# Altium schematic sheet Ethernet PHY.SchDoc
size A4; SheetNumber: 3; SheetTotal: 10
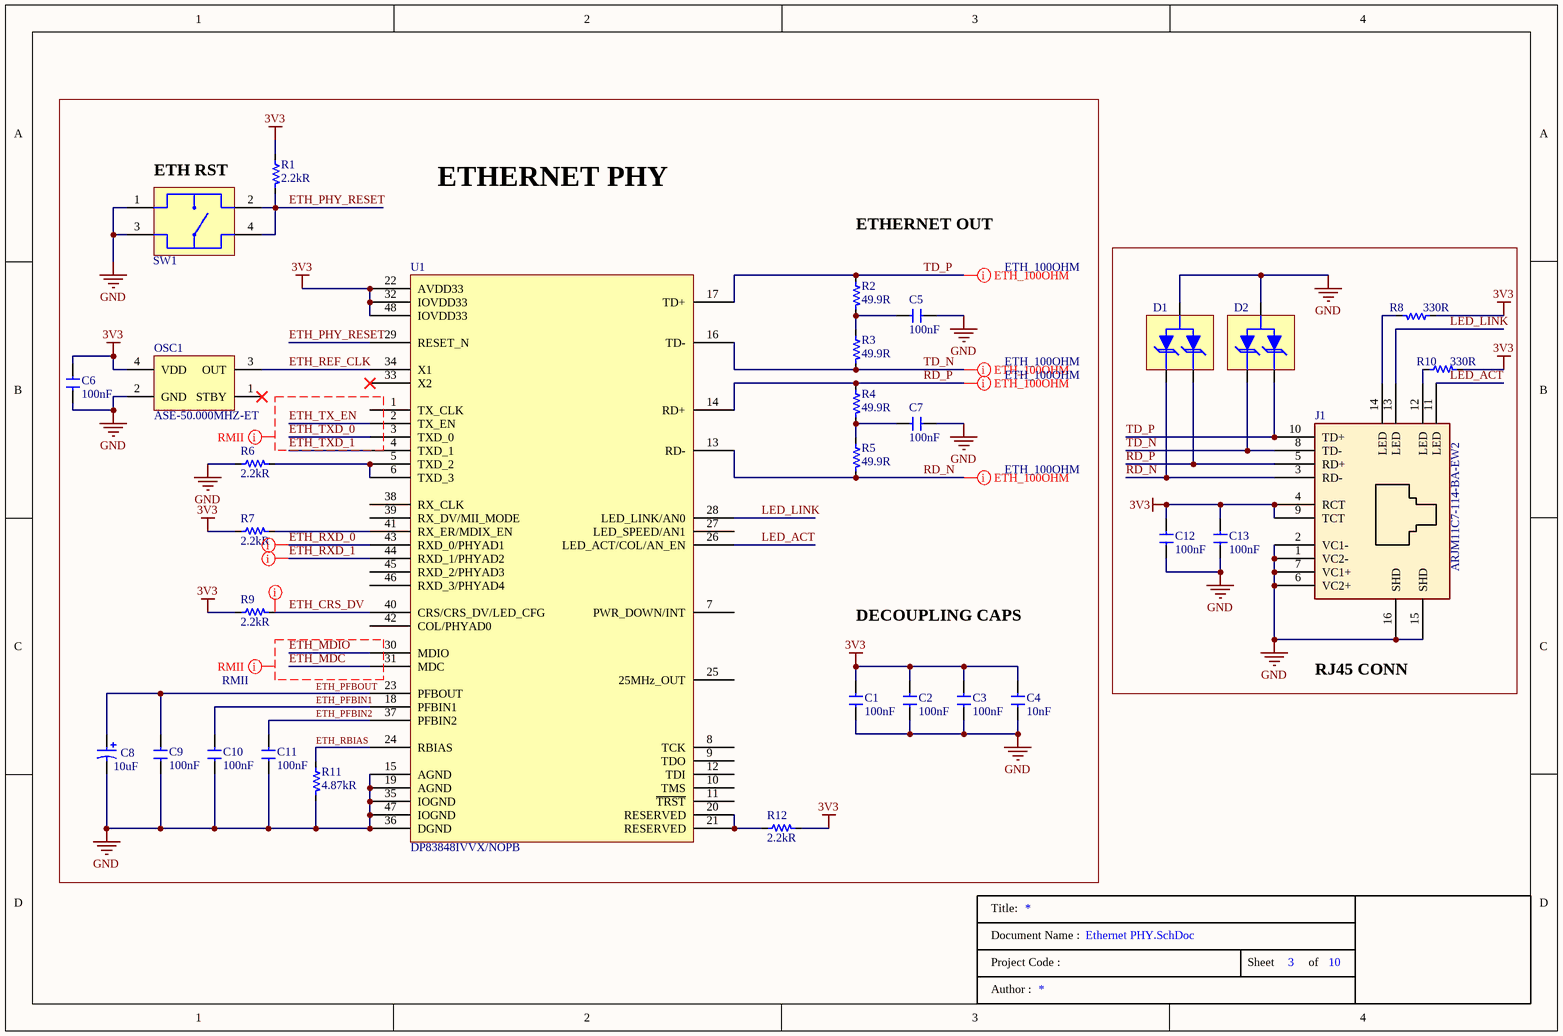
[diagram p0: Ethernet PHY.SchDoc]

## Parts
C1  Capacitance: 100nF  [0805_CAP]  (hidden comment: CAP_0.1uF_%20_50V_0805_X7R_CER)
C2  Capacitance: 100nF  [0805_CAP]  (hidden comment: CAP_0.1uF_%20_50V_0805_X7R_CER)
C3  Capacitance: 100nF  [0805_CAP]  (hidden comment: CAP_0.1uF_%20_50V_0805_X7R_CER)
C4  Capacitance: 10nF  [0805_CAP]  (hidden comment: CAP_10nF_%10_50V_0805_X7R_CER)
C5  Capacitance: 100nF  [0805_CAP]  (hidden comment: CAP_0.1uF_50V_0805_X7R_CER)
C6  Capacitance: 100nF  [0805_CAP]  (hidden comment: CAP_0.1uF_50V_0805_X7R_CER)
C7  Capacitance: 100nF  [0805_CAP]  (hidden comment: CAP_0.1uF_50V_0805_X7R_CER)
C8  Capacitance: 10uF  [1206_TANT_CAP]  (hidden comment: CAP_10uF_10V_10%_1206_TANT)
C9  Capacitance: 100nF  [0805_CAP]  (hidden comment: CAP_0.1uF_%20_50V_0805_X7R_CER)
C10  Capacitance: 100nF  [0805_CAP]  (hidden comment: CAP_0.1uF_%20_50V_0805_X7R_CER)
C11  Capacitance: 100nF  [0805_CAP]  (hidden comment: CAP_0.1uF_%20_50V_0805_X7R_CER)
C12  Capacitance: 100nF  [0805_CAP]  (hidden comment: CAP_0.1uF_50V_0805_X7R_CER)
C13  Capacitance: 100nF  [0805_CAP]  (hidden comment: CAP_0.1uF_50V_0805_X7R_CER)
D1  DIODE_TVS_3.3VWM_8VC_SOT23  [SOT170P237X110-3N]  (value not drawn)
D2  DIODE_TVS_3.3VWM_8VC_SOT23  [SOT170P237X110-3N]  (value not drawn)
J1  ARJM11C7-114-BA-EW2  [ARJM11C7-114-BA-EW2_ABR]
OSC1  ASE-50.000MHZ-ET  [4-SMD_CMOS_OSC_3.20MMX2.50]
R1  Resistance: 2.2kR  [0805_RES]  (hidden comment: RES_2.2K OHM_1%_0805_1/8W)
R2  Resistance: 49.9R  [0603_RES]  (hidden comment: RES_49.9 OHM_1%_0603_1/10W)
R3  Resistance: 49.9R  [0603_RES]  (hidden comment: RES_49.9 OHM_1%_0603_1/10W)
R4  Resistance: 49.9R  [0603_RES]  (hidden comment: RES_49.9 OHM_1%_0603_1/10W)
R5  Resistance: 49.9R  [0603_RES]  (hidden comment: RES_49.9 OHM_1%_0603_1/10W)
R6  Resistance: 2.2kR  [0805_RES]  (hidden comment: RES_2.2K OHM_1%_0805_1/8W)
R7  Resistance: 2.2kR  [0805_RES]  (hidden comment: RES_2.2K OHM_1%_0805_1/8W)
R8  Resistance: 330R  [0805_RES]  (hidden comment: RES_330 OHM_5%_0805_1/8W)
R9  Resistance: 2.2kR  [0805_RES]  (hidden comment: RES_2.2K OHM_1%_0805_1/8W)
R10  Resistance: 330R  [0805_RES]  (hidden comment: RES_330 OHM_5%_0805_1/8W)
R11  Resistance: 4.87kR  [0805_RES]  (hidden comment: RES_4.87K_OHM_1%_1/8W 0805)
R12  Resistance: 2.2kR  [0805_RES]  (hidden comment: RES_2.2K OHM_1%_0805_1/8W)
SW1  SWITCH_TACTILE_SPST-NO_0.05A_12V  [TACT_SWITCH_6MMX6MM]  (value not drawn)
U1  DP83848IVVX/NOPB  [TSQFP50P900X900X160-48N]

## Blocks framed on the sheet
ETHERNET PHY: C1-C11 OSC1 R1-R7 R9 R11 R12 SW1 U1
RJ45 CONN: C12 C13 D1 D2 J1 R8 R10

## Nets
3V3: C1.2 C2.2 C3.2 C4.2 C6.2 C12.1 C13.1 J1.4(RCT) J1.9(TCT) OSC1.4(VDD) R1.2 R7.2 R8.2 R9.2 R10.1 R12.1 U1.22(AVDD33) U1.32(IOVDD33) U1.48(IOVDD33)
GND: C1.1 C2.1 C3.1 C4.1 C5.1 C6.1 C7.1 C8.2 C9.1 C10.1 C11.1 C12.2 C13.2 D1.3(ANODE) D2.3(ANODE) J1.1(VC2-) J1.2(VC1-) J1.6(VC2+) J1.7(VC1+) J1.15(SHD) J1.16(SHD) OSC1.2(GND) R6.2 R11.1 SW1.1 SW1.3 U1.15(AGND) U1.19(AGND) U1.35(IOGND) U1.36(DGND) U1.47(IOGND)
ETH_CRS_DV: R9.1 U1.40(CRS/CRS_DV/LED_CFG)
ETH_MDC: U1.31(MDC)
ETH_MDIO: U1.30(MDIO)
ETH_PFBIN1: C10.2 U1.18(PFBIN1)
ETH_PFBIN2: C11.2 U1.37(PFBIN2)
ETH_PFBOUT: C8.1 C9.2 U1.23(PFBOUT)
ETH_PHY_RESET: R1.1 SW1.2 SW1.4 U1.29(RESET_N)
ETH_RBIAS: R11.2 U1.24(RBIAS)
ETH_REF_CLK: OSC1.3(OUT) U1.34(X1)
ETH_RXD_0: U1.43(RXD_0/PHYAD1)
ETH_RXD_1: U1.44(RXD_1/PHYAD2)
ETH_TX_EN: U1.2(TX_EN)
ETH_TXD_0: U1.3(TXD_0)
ETH_TXD_1: U1.4(TXD_1)
LED_ACT: J1.11(LED) U1.26(LED_ACT/COL/AN_EN)
LED_LINK: J1.13(LED) U1.28(LED_LINK/AN0)
RD_N: D1.1(CATHODE_1) J1.3(RD-) R5.1 U1.13(RD-)
RD_P: D1.2(CATHODE_2) J1.5(RD+) R4.2 U1.14(RD+)
TD_N: D2.1(CATHODE_1) J1.8(TD-) R3.1 U1.16(TD-)
TD_P: D2.2(CATHODE_2) J1.10(TD+) R2.2 U1.17(TD+)
NetC5_2: C5.2 R2.1 R3.2
NetC7_2: C7.2 R4.1 R5.2
NetJ1_12: J1.12(LED) R10.2
NetJ1_14: J1.14(LED) R8.1
NetR6_1: R6.1 U1.5(TXD_2) U1.6(TXD_3)
NetR7_1: R7.1 U1.41(RX_ER/MDIX_EN)
NetR12_2: R12.2 U1.20(RESERVED) U1.21(RESERVED)

Not connected (* = marked no-connect by the designer): OSC1 1(STBY)*; U1 1(TX_CLK) 7(PWR_DOWN/INT) 8(TCK) 9(TDO) 10(TMS) 11(~{TRST}) 12(TDI) 25(25MHz_OUT) 27(LED_SPEED/AN1) 33(X2)* 38(RX_CLK) 39(RX_DV/MII_MODE) 42(COL/PHYAD0) 45(RXD_2/PHYAD3) 46(RXD_3/PHYAD4)

## Layout directives
differential pair; differential pair class ETH_100OHM: RD_N, RD_P, TD_N, TD_P
net class RMII: ETH_CRS_DV, ETH_MDC, ETH_MDIO, ETH_RXD_0, ETH_RXD_1, ETH_TX_EN, ETH_TXD_0, ETH_TXD_1

## Notes on the sheet
- (near SW1) ETH RST
- (near R2) ETHERNET OUT
- DECOUPLING CAPS
- Title:
- Document Name :
- Project Code :
- Sheet
- of
- Author :

## Library data of the parts
C1-C3 C9-C11 = CAP_0.1uF_%20_50V_0805_X7R_CER: Cap Ceramic 0.1uF 50V X7R 20% SMD 0805 125C Paper T/R; Manufacturer: KEMET; Manufacturer Part Number: C0805C104M5RACTU; Supplier 1: Digi-Key; RoHS: Yes; Category: Ceramic Capacitors; Stock 1: 4863; Pricing 1: 1=0,10000, 10=0,06400, 50=0,03500, 100=0,02860, 500=0,02040, 1000=0,01603 (USD); Mount: Surface Mount; Case/Package: 0805; Dielectric Material: Ceramic; Min Operating Temperature: -55°C; Max Operating Temperature: 125°C; Tolerance: 20%; Dielectric: X7R; Packaging: Tape and Reel; Voltage Rating (DC): 50V; Length: 2mm; Height: 0.9mm; Depth: 1.25mm; Radiation Hardening: No; ComponentLink1URL: http://uk.rs-online.com/webdocs/13da/0900766b813daa06.pdf?src-supplier=RSComponents; ComponentLink1Description: http://uk.rs-online.com/webdocs/13da/0900766b813daa06.pdf?src-supplier=RSComponents; ComponentLink2URL: https://www.verical.com/server-webapp/html/getDatasheet?partID=774625&src-supplier=Verical; ComponentLink2Description: https://www.verical.com/server-webapp/html/getDatasheet?partID=774625&src-supplier=Verical; ComponentLink3URL: http://www.farnell.com/datasheets/2739857.pdf?src-supplier=Farnell; ComponentLink3Description: http://www.farnell.com/datasheets/2739857.pdf?src-supplier=Farnell; ComponentLink4URL: http://uk.rs-online.com/webdocs/1515/0900766b81515223.pdf?src-supplier=RSComponents; ComponentLink4Description: http://uk.rs-online.com/webdocs/1515/0900766b81515223.pdf?src-supplier=RSComponents; ComponentLink5URL: http://components.arrow.com/part/dataview/0323_00324812?src-supplier=Arrow+Europe; ComponentLink5Description: http://components.arrow.com/part/dataview/0323_00324812?src-supplier=Arrow+Europe; ComponentLink6URL: http://uk.rs-online.com/webdocs/1528/0900766b81528e2f.pdf?src-supplier=RSComponents; ComponentLink6Description: http://uk.rs-online.com/webdocs/1528/0900766b81528e2f.pdf?src-supplier=RSComponents; ComponentLink7URL: http://www.farnell.com/datasheets/2739857.pdf?src-supplier=Newark; ComponentLink7Description: http://www.farnell.com/datasheets/2739857.pdf?src-supplier=Newark; ComponentLink8URL: http://www.alliedelec.com/m/d/9bfe7773041ffe9d406e68bc7b377fdd.pdf?src-supplier=Allied+Electronics; ComponentLink8Description: http://www.alliedelec.com/m/d/9bfe7773041ffe9d406e68bc7b377fdd.pdf?src-supplier=Allied+Electronics; ComponentLink9URL: https://api.kemet.com/component-edge/download/datasheet/C0805C104M5RACTU.pdf?src-supplier=Digi-Key; ComponentLink9Description: https://api.kemet.com/component-edge/download/datasheet/C0805C104M5RACTU.pdf?src-supplier=Digi-Key; ComponentLink10URL: http://capacitoredge.kemet.com/capedge2/DataSheet?pn=C0805C104M5RACTU&src-supplier=Avnet+Europe; ComponentLink10Description: http://capacitoredge.kemet.com/capedge2/DataSheet?pn=C0805C104M5RACTU&src-supplier=Avnet+Europe; ComponentLink11URL: http://www.farnell.com/datasheets/2739857.pdf?src-supplier=Element14; ComponentLink11Description: http://www.farnell.com/datasheets/2739857.pdf?src-supplier=Element14; ComponentLink12URL: http://www.mouser.com/ds/2/212/KEM_C1002_X7R_SMD-1102033.pdf?src-supplier=Mouser; ComponentLink12Description: http://www.mouser.com/ds/2/212/KEM_C1002_X7R_SMD-1102033.pdf?src-supplier=Mouser; ComponentLink13URL: https://www.verical.com/server-webapp/html/getDatasheet?partID=91523&src-supplier=Verical; ComponentLink13Description: https://www.verical.com/server-webapp/html/getDatasheet?partID=91523&src-supplier=Verical; ComponentLink14URL: http://components.arrow.com/part/dataview/2091108S8109171N7429?src-supplier=Arrow+Electronics; ComponentLink14Description: http://components.arrow.com/part/dataview/2091108S8109171N7429?src-supplier=Arrow+Electronics; Supplier Part Number 1: 399-C0805C104M5RAC7800CT-ND
C4 = CAP_10nF_%10_50V_0805_X7R_CER: CAP CER 10000PF 50V X7R 0805; Manufacturer: Samsung; Manufacturer Part Number: CL21B103KBANNNC; Material: Ceramic; Tolerance: 10%; Supplier 1: Digi-Key; RoHS: Yes; Category: Ceramic Capacitors; Stock 1: 1431273; Pricing 1: 1=0,10000, 10=0,04600, 50=0,02500, 100=0,02050, 500=0,01464, 1000=0,01150 (USD); Mount: Surface Mount; Case/Package: 0805; Case Code (Metric): 2012; Case Code (Imperial): 0805; Contact Plating: Tin; Min Operating Temperature: -55°C; Max Operating Temperature: 125°C; Dielectric: X7R; Voltage: 50V; Voltage Rating (DC): 50V; Packaging: Tape and Reel; Voltage Rating: 50V; Series: CL; Construction: Flat; Length: 2mm; Width: 0.049inch; Height: 0.65mm; Depth: 1.25mm; Thickness: 0.03inch; Radiation Hardening: No; Lead Free: Lead Free; RoHS Compliant: Yes; ComponentLink1URL: https://datasheet.ciiva.com/25709/cl21b103kbannnc-25709781.pdf?src-supplier=Digi-Key; ComponentLink1Description: https://datasheet.ciiva.com/25709/cl21b103kbannnc-25709781.pdf?src-supplier=Digi-Key; ComponentLink2URL: https://datasheet.ciiva.com/29199/455082-da-01-en-vs-kondensator-0805-29199459.pdf?src-supplier=Conrad; ComponentLink2Description: https://datasheet.ciiva.com/29199/455082-da-01-en-vs-kondensator-0805-29199459.pdf?src-supplier=Conrad; Supplier Part Number 1: 1276-1015-1-ND
C5-C7 C12 C13 = CAP_0.1uF_50V_0805_X7R_CER: Cap Ceramic 0.1uF 50V X7R 20% SMD 0805 125C Paper T/R; Manufacturer: KEMET; Manufacturer Part Number: C0805C104M5RACTU; Supplier 1: Digi-Key; RoHS: Yes; Category: Ceramic Capacitors; Stock 1: 4863; Pricing 1: 1=0,10000, 10=0,06400, 50=0,03500, 100=0,02860, 500=0,02040, 1000=0,01603 (USD); Mount: Surface Mount; Case/Package: 0805; Dielectric Material: Ceramic; Min Operating Temperature: -55°C; Max Operating Temperature: 125°C; Tolerance: 20%; Dielectric: X7R; Packaging: Tape and Reel; Voltage Rating (DC): 50V; Length: 2mm; Height: 0.9mm; Depth: 1.25mm; Radiation Hardening: No; ComponentLink1URL: http://uk.rs-online.com/webdocs/13da/0900766b813daa06.pdf?src-supplier=RSComponents; ComponentLink1Description: http://uk.rs-online.com/webdocs/13da/0900766b813daa06.pdf?src-supplier=RSComponents; ComponentLink2URL: https://www.verical.com/server-webapp/html/getDatasheet?partID=774625&src-supplier=Verical; ComponentLink2Description: https://www.verical.com/server-webapp/html/getDatasheet?partID=774625&src-supplier=Verical; ComponentLink3URL: http://www.farnell.com/datasheets/2739857.pdf?src-supplier=Farnell; ComponentLink3Description: http://www.farnell.com/datasheets/2739857.pdf?src-supplier=Farnell; ComponentLink4URL: http://uk.rs-online.com/webdocs/1515/0900766b81515223.pdf?src-supplier=RSComponents; ComponentLink4Description: http://uk.rs-online.com/webdocs/1515/0900766b81515223.pdf?src-supplier=RSComponents; ComponentLink5URL: http://components.arrow.com/part/dataview/0323_00324812?src-supplier=Arrow+Europe; ComponentLink5Description: http://components.arrow.com/part/dataview/0323_00324812?src-supplier=Arrow+Europe; ComponentLink6URL: http://uk.rs-online.com/webdocs/1528/0900766b81528e2f.pdf?src-supplier=RSComponents; ComponentLink6Description: http://uk.rs-online.com/webdocs/1528/0900766b81528e2f.pdf?src-supplier=RSComponents; ComponentLink7URL: http://www.farnell.com/datasheets/2739857.pdf?src-supplier=Newark; ComponentLink7Description: http://www.farnell.com/datasheets/2739857.pdf?src-supplier=Newark; ComponentLink8URL: http://www.alliedelec.com/m/d/9bfe7773041ffe9d406e68bc7b377fdd.pdf?src-supplier=Allied+Electronics; ComponentLink8Description: http://www.alliedelec.com/m/d/9bfe7773041ffe9d406e68bc7b377fdd.pdf?src-supplier=Allied+Electronics; ComponentLink9URL: https://api.kemet.com/component-edge/download/datasheet/C0805C104M5RACTU.pdf?src-supplier=Digi-Key; ComponentLink9Description: https://api.kemet.com/component-edge/download/datasheet/C0805C104M5RACTU.pdf?src-supplier=Digi-Key; ComponentLink10URL: http://capacitoredge.kemet.com/capedge2/DataSheet?pn=C0805C104M5RACTU&src-supplier=Avnet+Europe; ComponentLink10Description: http://capacitoredge.kemet.com/capedge2/DataSheet?pn=C0805C104M5RACTU&src-supplier=Avnet+Europe; ComponentLink11URL: http://www.farnell.com/datasheets/2739857.pdf?src-supplier=Element14; ComponentLink11Description: http://www.farnell.com/datasheets/2739857.pdf?src-supplier=Element14; ComponentLink12URL: http://www.mouser.com/ds/2/212/KEM_C1002_X7R_SMD-1102033.pdf?src-supplier=Mouser; ComponentLink12Description: http://www.mouser.com/ds/2/212/KEM_C1002_X7R_SMD-1102033.pdf?src-supplier=Mouser; ComponentLink13URL: https://www.verical.com/server-webapp/html/getDatasheet?partID=91523&src-supplier=Verical; ComponentLink13Description: https://www.verical.com/server-webapp/html/getDatasheet?partID=91523&src-supplier=Verical; ComponentLink14URL: http://components.arrow.com/part/dataview/2091108S8109171N7429?src-supplier=Arrow+Electronics; ComponentLink14Description: http://components.arrow.com/part/dataview/2091108S8109171N7429?src-supplier=Arrow+Electronics; Supplier Part Number 1: 399-C0805C104M5RAC7800CT-ND
C8 = CAP_10uF_10V_10%_1206_TANT: Cap Tant Solid 10uF 10V A CASE 10% (3.2 X 1.6 X 1.6mm) Inward L SMD 3216-18 3 Ohm 125C T/R; Manufacturer: Kyocera AVX; Manufacturer Part Number: TAJA106K010SNJ; ESR (Equivalent Series Resistance): 3R; Leakage Current: 1uA; Polarity: Polar; Dissipation Factor: 6%; Supplier 1: Digi-Key; RoHS: Yes; Category: Tantalum Capacitors; Stock 1: 14579; Pricing 1: 1=0,31000, 10=0,21300, 50=0,14920, 100=0,12780, 500=0,09584, 1000=0,08094, 2500=0,07668 (USD); Case/Package: Molded; Number of Pins: 2; Case Code (Imperial): 1206; Case Code (Metric): 3216; Min Operating Temperature: -55°C; Max Operating Temperature: 125°C; Tolerance: 10%; Packaging: Tape and Reel; Voltage Rating: 10V; Package Quantity: 8000; Termination: SMD/SMT; Voltage Rating (DC): 10V; Series: TAJ; Construction: Flat; Length: 3.2mm; Width: 1.6mm; Height: 1.8mm; Depth: 1.6mm; Radiation Hardening: No; Lead Free: Lead Free; RoHS Compliant: Yes; ComponentLink1URL: https://datasheet.ciiva.com/12909/taj-27497-12909898.pdf?src-supplier=Mouser; ComponentLink1Description: https://datasheet.ciiva.com/12909/taj-27497-12909898.pdf?src-supplier=Mouser; Supplier Part Number 1: 478-13122-1-ND
D1 D2 = DIODE_TVS_3.3VWM_8VC_SOT23: ESD Suppressor TVS Uni-Dir 3.3V 3-Pin SOT-23 T/R; Manufacturer: MCC; Manufacturer Part Number: ESD3V3AP-TP; Number of Unidirectional Channels: 2; Min Breakdown Voltage: 5V; Clamping Voltage: 7.5V; Peak Pulse Current: 13.3A; Peak Pulse Power: 300W; Power Line Protection: No; Supplier 1: Digi-Key; RoHS: Yes; Category: TVS Diodes; Stock 1: 509; Pricing 1: 1=0,35000, 10=0,26400, 100=0,14950, 500=0,09900, 1000=0,07590 (USD); Mount: Surface Mount; Case/Package: TO-236-3; Min Operating Temperature: -55°C; Max Operating Temperature: 150°C; Resistor Type: Zener; Packaging: Tape and Reel; Reverse Standoff Voltage: 3.3V; RoHS Compliant: Yes; ComponentLink1URL: http://www.mccsemi.com/up_pdf/ESD3V3AP(SOT-23).pdf?src-supplier=Digi-Key; ComponentLink1Description: http://www.mccsemi.com/up_pdf/ESD3V3AP(SOT-23).pdf?src-supplier=Digi-Key; ComponentLink2URL: https://www.mccsemi.com/pdf/Products/ESD3V3AP(SOT-23).pdf?src-supplier=Digi-Key; ComponentLink2Description: https://www.mccsemi.com/pdf/Products/ESD3V3AP(SOT-23).pdf?src-supplier=Digi-Key; Supplier Part Number 1: ESD3V3AP-TPMSCT-ND
J1 = CONN_RJ-45_JACK_1PORT 100 BASE-T PoE_w/LED: Conn RJ-45 F 8 POS 1.27mm Solder RA Thru-Hole 14 Terminal 1 Port Tray; Manufacturer: Abracon; Connector Type: RJ45; Direction: Up; Number of Ports: 1; Number of Cores per Jack: 4; Shielding: Shielded; Supplier 1: Digi-Key; Manufacturer Part Number: ARJM11C7-114-BA-EW2; RoHS: Yes; Category: Modular / Ethernet Connectors; Stock 1: 66; Pricing 1: 1=3,29000, 10=2,98300, 25=2,82560, 40=2,76000, 100=2,62850, 300=2,29993, 500=2,23420, 1000=1,90565, 2400=1,77423 (USD); Mount: Through Hole; Color: Green,Yellow; Contact Plating: Gold; Min Operating Temperature: -40°C; Max Operating Temperature: 85°C; Packaging: Tray; Number of Rows: 1; Termination: Solder; RoHS Compliant: Yes; Supplier Part Number 1: 535-14168-ND
OSC1 = XTAL_OSC_XO_50.0000MHZ_CMOS_SMD: 3.2 X 2.5 X 1.1Mm, 3.3V , 100Ppm -20+70C, Smd Ceramic Oscillator Rohs Compliant: Yes; Manufacturer: Abracon; Frequency: 50MHz; Load Capacitance: 15pF; Max Supply Current: 19mA; Supplier 1: Digi-Key; RoHS: Yes; Category: Oscillators; Stock 1: 12937; Pricing 1: 1=1,38000, 10=1,32100, 50=1,29020, 100=1,10590, 500=1,07520 (USD); Mount: Surface Mount; Case/Package: SMD/SMT; Number of Pins: 4; Min Operating Temperature: -20°C; Max Operating Temperature: 70°C; Packaging: Tape and Reel; Operating Supply Voltage: 3.3V; Frequency Stability: 100ppm; Termination: SMD/SMT; Series: ASE; Length: 3.2mm; Width: 2.5mm; Height: 0.047inch; Depth: 2.5mm; Radiation Hardening: No; REACH SVHC: No SVHC; Lead Free: Lead Free; ComponentLink1URL: https://datasheet.ciiva.com/865/aseseries-865948.pdf?src-supplier=Digi-Key; ComponentLink1Description: https://datasheet.ciiva.com/865/aseseries-865948.pdf?src-supplier=Digi-Key; ComponentLink2URL: https://datasheet.ciiva.com/865/aseseries-865947.pdf?src-supplier=Digi-Key; ComponentLink2Description: https://datasheet.ciiva.com/865/aseseries-865947.pdf?src-supplier=Digi-Key; ComponentLink3URL: https://datasheet.ciiva.com/865/aseseries-865949.pdf?src-supplier=Digi-Key; ComponentLink3Description: https://datasheet.ciiva.com/865/aseseries-865949.pdf?src-supplier=Digi-Key; ComponentLink4URL: https://datasheet.ciiva.com/3177/aseseries-3177741.pdf?src-supplier=Avnet; ComponentLink4Description: https://datasheet.ciiva.com/3177/aseseries-3177741.pdf?src-supplier=Avnet; ComponentLink5URL: https://datasheet.ciiva.com/16413/aseseries-16413061.pdf?src-supplier=Future+Electronics; ComponentLink5Description: https://datasheet.ciiva.com/16413/aseseries-16413061.pdf?src-supplier=Future+Electronics; Manufacturer Part Number: ASE-50.000MHZ-ET; Supplier Part Number 1: 535-9996-1-ND
R1 R6 R7 R9 R12 = RES_2.2K OHM_1%_0805_1/8W: Res Thick Film 0805 2.2K Ohm 1% 1/8W ±100ppm/°C SMD Paper T/R; Manufacturer: Yageo; Manufacturer Part Number: RC0805FR-132K2L; Power Rating: 125mW; Voltage Rating: 150V; Supplier 1: Digi-Key; RoHS: Yes; Category: Chip SMD Resistors; Stock 1: 72435; Pricing 1: 1=0,10000, 10=0,04200, 100=0,01690, 1000=0,00759, 2500=0,00659, 5000=0,00544 (USD); Case/Package: 0805; Contact Plating: Tin,Matte,Lead; Case Code (Imperial): 0805; Case Code (Metric): 2012; Min Operating Temperature: -55°C; Max Operating Temperature: 155°C; Tolerance: 1%; Resistor Type: Thick Film; Temperature Coefficient: 100ppm/°C; Packaging: Tape and Reel; Termination: SMD/SMT; Series: RC; Length: 2mm; Width: 1.25mm; Height: 0.5mm; Radiation Hardening: No; RoHS Compliant: Yes; ComponentLink1URL: https://datasheet.ciiva.com/12575/rc0805-257173-12575737.pdf?src-supplier=Mouser; ComponentLink1Description: https://datasheet.ciiva.com/12575/rc0805-257173-12575737.pdf?src-supplier=Mouser; Supplier Part Number 1: 13-RC0805FR-132K2LCT-ND
R2-R5 = RES_49.9 OHM_1%_0603_1/10W: Res Thick Film 0603 49.9 Ohm 1% 1/10W ±100ppm/°C Molded SMD Paper T/R; Manufacturer: Vishay; Manufacturer Part Number: CRCW060349R9FKEAC; Power Rating: 100mW; Supplier 1: Digi-Key; RoHS: Yes; Category: Chip SMD Resistors; Stock 1: 639478; Pricing 1: 1=0,10000, 10=0,03600, 100=0,01450, 1000=0,00652, 2500=0,00566 (USD); Mount: Surface Mount; Case/Package: Molded; Contact Plating: Tin; Min Operating Temperature: -55°C; Max Operating Temperature: 155°C; Tolerance: 1%; Resistor Type: Thick Film; Termination: Wraparound; Temperature Coefficient: 100ppm/°C; Length: 1.55mm; Lead Free: Lead Free; RoHS Compliant: Yes; ComponentLink1URL: http://www.vishay.com/docs/28773/crcwce3.pdf?src-supplier=Digi-Key; ComponentLink1Description: http://www.vishay.com/docs/28773/crcwce3.pdf?src-supplier=Digi-Key; Supplier Part Number 1: 541-3955-1-ND
R8 R10 = RES_330 OHM_5%_0805_1/8W: Res Thick Film 0805 330 Ohm 5% 0.125W(1/8W) ±100ppm/C Pad SMD Automotive T/R; Manufacturer: TE Connectivity; Manufacturer Part Number: CRGCQ0805J330R; Supplier 1: Digi-Key; RoHS: Yes; Category: Chip SMD Resistors; Stock 1: 75221; Pricing 1: 1=0,10000, 10=0,04400, 100=0,01780, 1000=0,00798, 2500=0,00693 (USD); ComponentLink1URL: https://www.te.com/commerce/DocumentDelivery/DDEController?Action=srchrtrv&amp;DocNm=1773204-3&amp;DocType=DS&amp;DocLang=English&src-supplier=Digi-Key; ComponentLink1Description: https://www.te.com/commerce/DocumentDelivery/DDEController?Action=srchrtrv&amp;DocNm=1773204-3&amp;DocType=DS&amp;DocLang=English&src-supplier=Digi-Key; Supplier Part Number 1: A130131CT-ND
R11 = RES_4.87K_OHM_1%_1/8W 0805: Res Thick Film 0805 4.87K Ohm 1% 1/8W ±100ppm/°C SMD Paper T/R; Manufacturer: Yageo; Manufacturer Part Number: RC0805FR-074K87L; Power Rating: 125mW; Voltage Rating: 150V; RoHS: Yes; Category: Chip SMD Resistors; Stock 1: 89972; Pricing 1: 1=0,10000, 10=0,04200, 100=0,01690, 1000=0,00759, 2500=0,00659 (USD); Case/Package: 0805; Case Code (Imperial): 0805; Case Code (Metric): 2012; Contact Plating: Tin,Matte,Lead; Size Code: 0805; Weight: 0.000194oz; Min Operating Temperature: -55°C; Max Operating Temperature: 155°C; Tolerance: 1%; Packaging: Tape and Reel; Termination: SMD/SMT; Resistor Type: Thick Film; Temperature Coefficient: 100ppm/°C; Voltage Rating (DC): 150V; Features: Moisture Resistant; Series: RC; Max Power Dissipation: 125mW; Number of Terminations: 2; Construction: Rectangular; Length: 2mm; Width: 1.25mm; Height: 0.5mm; Depth: 1.25mm; Radiation Hardening: No; Military Standard: Not; Lead Free: Lead Free; RoHS Compliant: Yes; ComponentLink1URL: https://datasheet.ciiva.com/12577/rc0805-12577484.pdf?src-supplier=Mouser; ComponentLink1Description: https://datasheet.ciiva.com/12577/rc0805-12577484.pdf?src-supplier=Mouser; Supplier Part Number 1: 311-4.87KCRCT-ND; Supplier 1: Digi-Key
SW1 = SWITCH_TACTILE_SPST-NO_0.05A_12V: Switch Tactile N.O. SPST Round Button Gull Wing 0.05A 12VDC 100000Cycles 1.27N SMD T/R; Manufacturer: ITT C&K; Manufacturer Part Number: PTS645SL43SMTR92LFS; Actuator Material: Nylon,Polyamide,PA66; Max Voltage Rating (DC): 12V; Contact Resistance: 100mR; Max Current Rating: 50mA; Illumination Type: Non-Illuminated; Switch Function: Off-Mom; Actuator Type: Standard; Actuator Length: 0.85mm; Supplier 1: Digi-Key; RoHS: Yes; Category: Tactile Switches; Stock 1: 52166; Pricing 1: 1=0,15000, 10=0,14900, 25=0,14160, 100=0,12870, 250=0,12104, 500=0,11072 (USD); Mount: Surface Mount; Contact Material: Bronze,Brass,Silver; Contact Plating: Silver; Mechanical Life: 100000Cycles; Color: Black; Min Operating Temperature: -20°C; Max Operating Temperature: 60°C; Throw Configuration: SPST; Operating Force: 1.27N; Packaging: Tape and Reel; Termination: Gull Wing; Voltage Rating (DC): 12V; Package Quantity: 1000; Current Rating: 50mA; Orientation: Straight; Series: PTS645; Length: 6mm; Depth: 9mm; Size: 6mm; Lead Free: Lead Free; RoHS Compliant: Yes; ComponentLink1URL: https://datasheet.ciiva.com/26927/getdatasheetpartid-774114-26927132.pdf?src-supplier=Verical; ComponentLink1Description: https://datasheet.ciiva.com/26927/getdatasheetpartid-774114-26927132.pdf?src-supplier=Verical; Supplier Part Number 1: CKN10880CT-ND
U1 = IC_PHY_DP83848I: 1/1 Transceiver  Ethernet 48-LQFP (7x7); Manufacturer: TI National Semiconductor; Operating Supply Voltage: 3.3V; Data Rate: 100Mbps; Min Supply Voltage: 3V; Max Supply Voltage: 3.6V; Number of Channels: 1; Nominal Supply Current: 92mA; Max Power Dissipation: 267mW; Cable Length: 150m; Supplier 1: Digi-Key; Manufacturer Part Number: DP83848IVVX/NOPB; RoHS: Yes; Category: Interface ICs; Pricing 1: 1=5,98000, 10=5,37400, 25=5,08000, 100=4,40270, 250=4,17692, 500=3,74794 (USD); Mount: Surface Mount; Case/Package: LQFP; Number of Pins: 48; Weight: 0.006409oz; Min Operating Temperature: -40°C; Max Operating Temperature: 85°C; Package Quantity: 1000; Series: -; Packaging: Tape and Reel; Supply Current: 92mA; Number of Transceivers: 1; Max Supply Current: 92mA; Radiation Hardening: No; REACH SVHC: No SVHC; RoHS Compliant: Yes; Lead Free: Lead Free; ComponentLink1URL: https://datasheet.ciiva.com/34302/1446303-34302318.pdf?src-supplier=Jameco; ComponentLink1Description: https://datasheet.ciiva.com/34302/1446303-34302318.pdf?src-supplier=Jameco; ComponentLink2URL: https://datasheet.ciiva.com/6635/dp83848i-6635680.pdf?src-supplier=Digi-Key; ComponentLink2Description: https://datasheet.ciiva.com/6635/dp83848i-6635680.pdf?src-supplier=Digi-Key; ComponentLink3URL: https://datasheet.ciiva.com/6635/dp83848i-6635679.pdf?src-supplier=Digi-Key; ComponentLink3Description: https://datasheet.ciiva.com/6635/dp83848i-6635679.pdf?src-supplier=Digi-Key; Supplier Part Number 1: DP83848IVVX/NOPBCT-ND